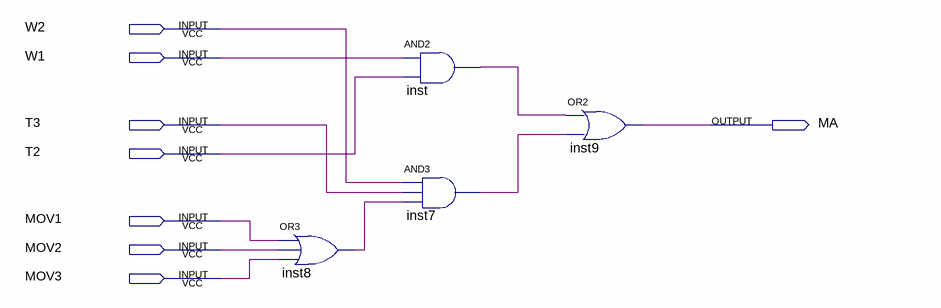
[diagram p0: schematic sheet]
// Quartus schematic MA.bdf as structural Verilog: 4 symbols, 8 pins
module MA (
  input  W2,
  input  W1,
  input  T3,
  input  T2,
  input  MOV1,
  input  MOV2,
  input  MOV3,
  output MA
);

  wire inst7_out, inst8_out, inst_out;

  or inst8 (inst8_out, MOV1, MOV2, MOV3);
  and inst (inst_out, W1, T2);
  and inst7 (inst7_out, W2, T3, inst8_out);
  or inst9 (MA, inst_out, inst7_out);
endmodule
